# Altium schematic sheet heater.SchDoc
size A4
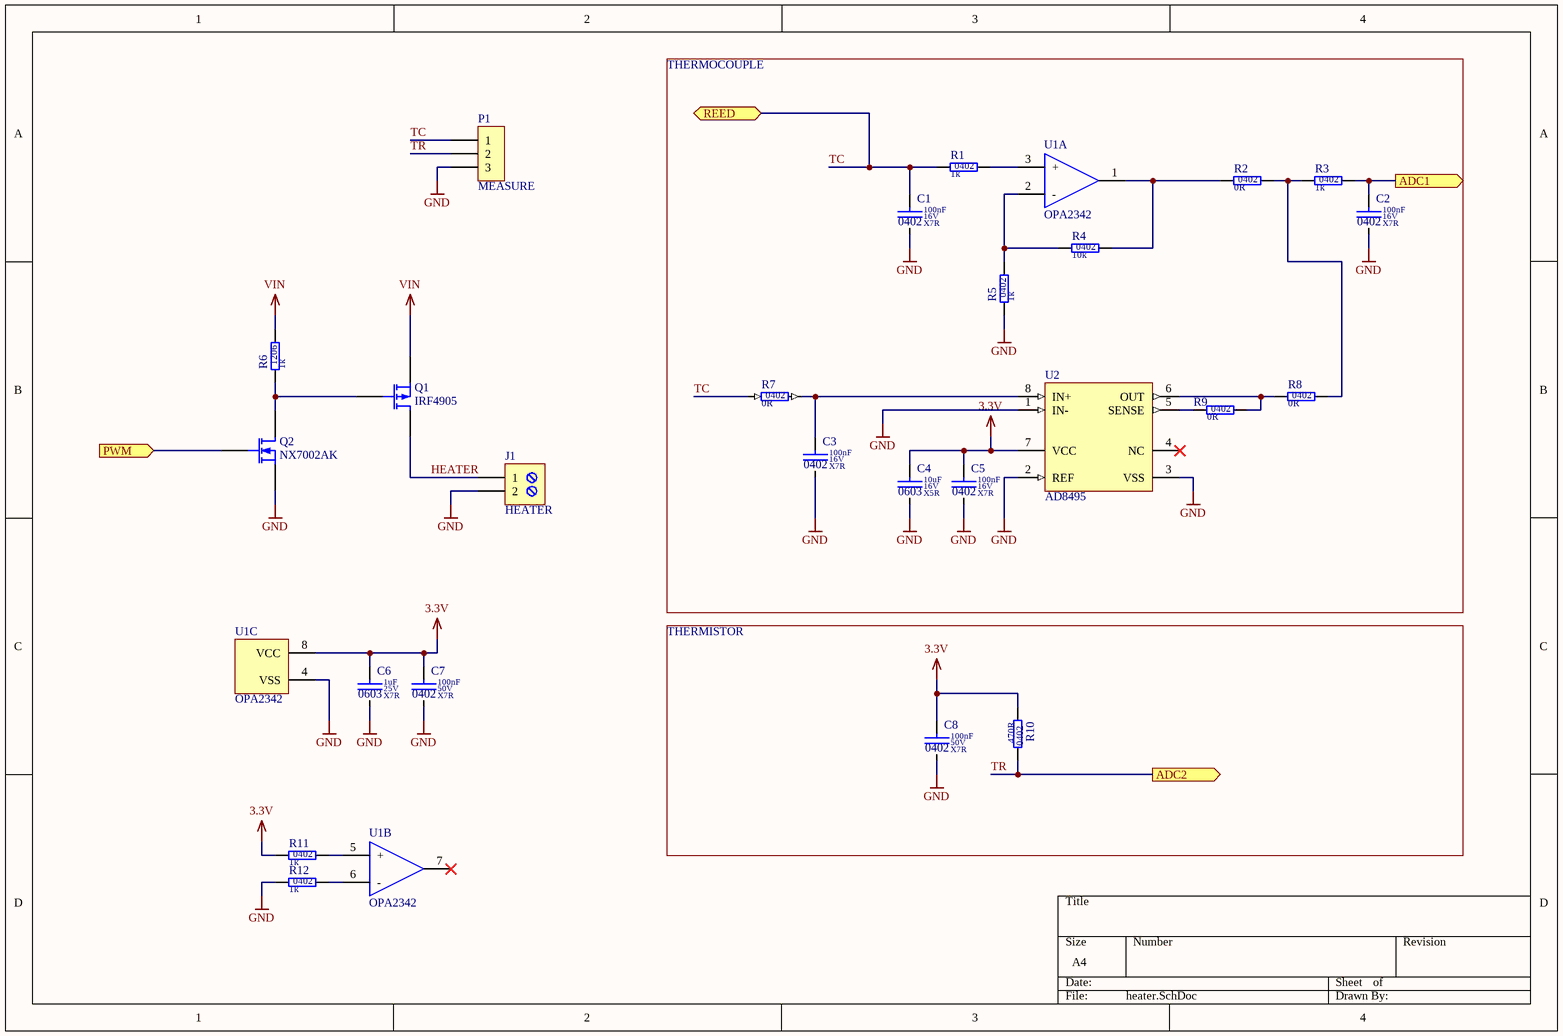
[diagram p0: heater.SchDoc]

## Parts
C1  value 100nF  Dielectric: X7R  Voltage: 16V  SCH_Footprint: 0402  [C_0402_1005]  (hidden comment: Ceramic X7R)
C2  value 100nF  Dielectric: X7R  Voltage: 16V  SCH_Footprint: 0402  [C_0402_1005]  (hidden comment: Ceramic X7R)
C3  value 100nF  Dielectric: X7R  Voltage: 16V  SCH_Footprint: 0402  [C_0402_1005]  (hidden comment: Ceramic X7R)
C4  value 10uF  Dielectric: X5R  Voltage: 16V  SCH_Footprint: 0603  [C_0603_1608]  (hidden comment: Ceramic X5R)
C5  value 100nF  Dielectric: X7R  Voltage: 16V  SCH_Footprint: 0402  [C_0402_1005]  (hidden comment: Ceramic X7R)
C6  value 1uF  Dielectric: X7R  Voltage: 25V  SCH_Footprint: 0603  [C_0603_1608]  (hidden comment: Ceramic X7R)
C7  value 100nF  Dielectric: X7R  Voltage: 50V  SCH_Footprint: 0402  [C_0402_1005]  (hidden comment: Ceramic X7R)
C8  value 100nF  Dielectric: X7R  Voltage: 50V  SCH_Footprint: 0402  [C_0402_1005]  (hidden comment: Ceramic X7R)
J1  HEATER  [J_ARK2]
P1  MEASURE  [P_HEADER_1x3_2.54_ANGLE]
Q1  IRF4905  [IRF4905]
Q2  NX7002AK  [NX7002AK.215]
R1  value 1k  SCH_Footprint: 0402  [R_0402_1005]  (hidden comment: Resistor)
R2  value 0R  SCH_Footprint: 0402  [R_0402_1005]  (hidden comment: Resistor)
R3  value 1k  SCH_Footprint: 0402  [R_0402_1005]  (hidden comment: Resistor)
R4  value 10k  SCH_Footprint: 0402  [R_0402_1005]  (hidden comment: Resistor)
R5  value 1k  SCH_Footprint: 0402  [R_0402_1005]  (hidden comment: Resistor)
R6  value 1k  SCH_Footprint: 1206  [R_1206_3216]  (hidden comment: Resistor)
R7  value 0R  SCH_Footprint: 0402  [R_0402_1005]  (hidden comment: Resistor)
R8  value 0R  SCH_Footprint: 0402  [R_0402_1005]  (hidden comment: Resistor)
R9  value 0R  SCH_Footprint: 0402  [R_0402_1005]  (hidden comment: Resistor)
R10  value 470R  SCH_Footprint: 0402  [R_0402_1005]  (hidden comment: Resistor)
R11  value 1k  SCH_Footprint: 0402  [R_0402_1005]  (hidden comment: Resistor)
R12  value 1k  SCH_Footprint: 0402  [R_0402_1005]  (hidden comment: Resistor)
U1  OPA2342  [OPA2342]  (parts A,B,C of 3)
U2  AD8495  [AD8494]

## Blocks framed on the sheet
THERMOCOUPLE: C1-C5 R1-R5 R7-R9 U1 U2
THERMISTOR: C8 R10

## Ports
ADC1 (out), ADC2 (out), PWM (in), REED (bidir)

## Nets
3.3V: C4.1 C5.1 C6.1 C7.1 C8.1 R10.1 R11.1 U1.8(VCC) U2.7(VCC)
GND: C1.2 C2.2 C3.2 C4.2 C5.2 C6.2 C7.2 C8.2 J1.2 P1.3 Q2.2(S) R5.1 R12.1 U1.4(VSS) U2.1(IN-) U2.2(REF) U2.3(VSS)
VIN: Q1.3(S) R6.2
ADC1: C2.1 R3.2 ; port ADC1
HEATER: J1.1 Q1.2(D)
PWM: Q2.1(G) ; port PWM
TC: C1.1 P1.1 R1.1 R7.1 ; port REED
TR: P1.2 R10.2 ; port ADC2
NetC3_1: C3.1 R7.2 U2.8(IN+)
NetQ1_1: Q1.1(G) Q2.3(D) R6.1
NetR1_2: R1.2 U1.3(+)
NetR2_1: R2.1 R4.2 U1.1(OUT)
NetR2_2: R2.2 R3.1 R8.2
NetR4_1: R4.1 R5.2 U1.2(-)
NetR8_1: R8.1 R9.2 U2.6(OUT)
NetR9_1: R9.1 U2.5(SENSE)
NetR11_2: R11.2 U1.5(+)
NetR12_2: R12.2 U1.6(-)

Not connected (* = marked no-connect by the designer): U1 7(OUT)*; U2 4(NC)*

## Library data of the parts
C1-C3 C5 = C_100nF_16V_X7R_0402_10: Capacitor; Manufacturer: Murata; Manufacturer Part Number: GRM155R71C104KA88D; Tolerance (%): 10; Part Number: C_100nF_16V_X7R_0402_10; HelpURL: https://www.mouser.com/ds/2/281/c02e-2905.pdf; Supplier 1: TME; Supplier 2: RS Components; Supplier 3: Farnell; Supplier 4: Mouser; Supplier Part Number 4: 81-GRM155R71C104KA88; Supplier 5: Digi-Key
  C2: Supplier 6: LCSC
C4 = C_10uF_16V_X5R_0603_20: Capacitor; Manufacturer: Samsung Electro-Mechanics; Manufacturer Part Number: CL10A106MO8NQNC; Tolerance (%): 20; Part Number: C_10uF_16V_X5R_0603_20; HelpURL: http://www.tme.eu/pl/Document/4a42202b32dab16128fe107dd69598cc/samsung-chip-cap.pdf; Supplier 1: TME; Supplier Part Number 1: CL10A106MO8NQNC; Supplier 2: RS Components; Supplier 3: Farnell; Supplier 4: Mouser; Supplier 5: Digi-Key
C6 = C_1uF_25V_X7R_0603_10: Capacitor; Manufacturer: Samsung; Manufacturer Part Number: CL10B105KA8NNNC; Tolerance (%): 10; Part Number: C_1uF_25V_X7R_0603_10; HelpURL: http://www.tme.eu/pl/Document/4a42202b32dab16128fe107dd69598cc/samsung-chip-cap.pdf; Supplier 1: TME; Supplier Part Number 1: CL10B105KA8NNNC; Supplier 2: RS Components; Supplier 3: Farnell; Supplier 4: Mouser; Supplier 5: Digi-Key
C7 C8 = C_100nF_50V_X7R_0402_10: Capacitor; Manufacturer: Murata; Manufacturer Part Number: GRM155R71H104KE14D; Tolerance (%): 10; Part Number: C_100nF_50V_X7R_0402_10; HelpURL: http://docs-europe.electrocomponents.com/webdocs/145f/0900766b8145f9d2.pdf; Supplier 1: TME; Supplier Part Number 1: GRM155R71H104KE14D; Supplier 2: RS Components; Supplier Part Number 2: 8847087; Supplier 3: Farnell; Supplier Part Number 3: 2611912; Supplier 4: Mouser; Supplier Part Number 4: 81-GRM155R71H104KE4D; Supplier 5: Digi-Key; Supplier Part Number 5: 490-10700-1-ND
J1 = J_TB-5.0-P-2P: ARK Screw terminal, 2-Pin; Manufacturer: DEGSON ELECTRONICS; Value: DG301-5.0-02P-12-18A(H); SCH_Footprint: ARK2; Part Number: J_TB-5.0-P-2P; Component Type: Standard; HelpURL: https://datasheet.octopart.com/DG301-5.0-03P-12-18A%28H%29-Degson-datasheet-17801202.pdf; Manufacturer Part Number: DG301-5.0-02P-12-18A(H); Supplier 1: TME; Supplier Part Number 1: DG301-5.0-2/6B; Supplier 2: RS Components; Supplier 3: Farnell; Supplier 4: Mouser; Supplier 5: Digi-Key
P1 = P_HEADER_1x3_2.54_ANGLE: Pin Header; Manufacturer: Molex; SCH_Footprint: 1x3 2.54mm; Value: 22-28-8032; Part Number: P_HEADER_1x3_2.54_ANGLE; HelpURL: https://datasheet.octopart.com/022288032-Molex-datasheet-8335722.pdf; Manufacturer Part Number: 22-28-8032; Supplier 1: TME; Supplier 2: RS Components; Supplier 3: Farnell; Supplier 4: Mouser; Supplier Part Number 4: 538-22-28-8032; Supplier 5: Digi-Key; Supplier Part Number 5: WM50015-03-ND; Supplier 6: LCSC
Q1 = IRF4905: PMOS TO-220
Q2 = NX7002AK.215: Tranzystor: N-MOSFET; unipolarny; 60V; 0,12A; 325mW; SOT23
R1 R3 R5 R11 R12 = R_1k_0402_1: Manufacturer: Yageo; Manufacturer Part Number: RC0402FR-071K; Voltage: 50V; Power: 63mW; Tolerance: 1%; Part Number: R_1k_0402_1; HelpURL: http://www.tme.eu/pl/Document/1a2bc76e2be68b3b1670068306778ce6/rc0402yageo.pdf; Supplier 1: TME; Supplier Part Number 1: RC0402FR-071K; Supplier 2: RS Components; Supplier 3: Farnell; Supplier Part Number 3: 9239235; Supplier 4: Mouser; Supplier Part Number 4: 603-RC0402FR-071KP; Supplier 5: Digi-Key; Supplier Part Number 5: 311-1.00KLRCT-ND
  R3: Supplier 6: LCSC
R2 R7-R9 = R_0R_0402_5: Manufacturer: Rohm; Manufacturer Part Number: PMR01ZZPJ000; Voltage: 50V; Power: 100mW; Tolerance: 5%; Part Number: R_0R_0402_5; HelpURL: https://pl.mouser.com/datasheet/2/348/pmr-jpw-e-1139188.pdf; Supplier 1: TME; Supplier 2: RS Components; Supplier 3: Farnell; Supplier 4: Mouser; Supplier Part Number 4: 755-PMR01ZZPJ000; Supplier 5: Digi-Key; Supplier Part Number 5: RHM1692-6-ND
R4 = R_10k_0402_1: Manufacturer: Yageo; Manufacturer Part Number: RC0402FR-0710KL; Voltage: 50V; Power: 63mW; Tolerance: 1%; Part Number: R_10k_0402_1; HelpURL: http://www.tme.eu/pl/Document/1a2bc76e2be68b3b1670068306778ce6/rc0402yageo.pdf; Supplier 1: TME; Supplier Part Number 1: RC0402FR-0710K; Supplier 2: RS Components; Supplier 3: Farnell; Supplier 4: Mouser; Supplier 5: Digi-Key
R6 = R_47k_1206_1: Manufacturer: Royalohm; Manufacturer Part Number: HP06W2F4702T5E; Voltage: 200V; Power: 500mW; Tolerance: 1%; Part Number: R_47k_1206_1; HelpURL: https://www.tme.eu/pl/Document/fa390a0a31e891a154d3713216995c6e/HighPowerHP.pdf; Supplier 1: TME; Supplier Part Number 1: HP06-47K1%; Supplier 2: RS Components; Supplier 3: Farnell; Supplier 4: Mouser; Supplier 5: Digi-Key
R10 = R_470R_0402_1: Manufacturer: Yageo; Manufacturer Part Number: RC0402FR-07470RL; Voltage: 50V; Power: 63mW; Tolerance: 1%; Part Number: R_470R_0402_1; HelpURL: http://datasheet.octopart.com/RC0402FR-07470RL-Yageo-datasheet-10408619.pdf; Supplier 1: TME; Supplier Part Number 1: RC0402FR-07470R; Supplier 2: RS Components; Supplier 3: Farnell; Supplier Part Number 3: 9239197; Supplier 4: Mouser; Supplier Part Number 4: 603-RC0402FR-07470RL; Supplier 5: Digi-Key; Supplier Part Number 5: 311-470LRCT-ND
U1 = OPA2342: Wzmacniacz operacyjny; 1MHz; 2,7÷5,5V; Kanały: 2; SO8
U2 = AD8495: Precision Thermocouple Amplifiers / with Cold Junction Compensation